# Altium schematic sheet USB.SchDoc
size 420 x 297 mm; Scale: 1:1; DocumentType: Схема электрическая принципиальная; FirstReferrence: АБВГ.123456.001
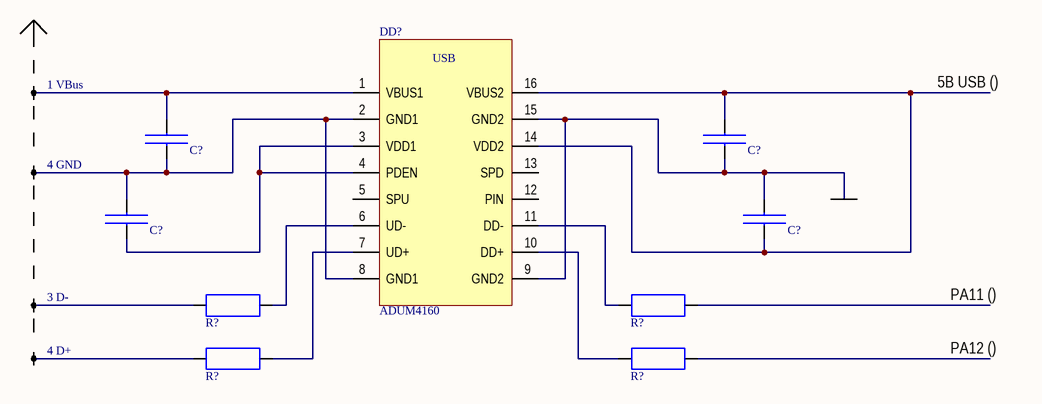
[diagram p0: USB.SchDoc]

## Parts
(Parts that share a designator on the sheet are numbered #1, #2 ... from top to bottom, then left to right.)
C?#1  C_2  (value not drawn)
C?#2  C_2  (value not drawn)
C?#3  C_2  (value not drawn)
C?#4  C_2  (value not drawn)
DD?  ADUM4160  [SOIC127P1030X265-16N]
R?#1  R_1  (value not drawn)
R?#2  R_1  (value not drawn)
R?#3  R_1  (value not drawn)
R?#4  R_1  (value not drawn)
X?#1  1 VBus  [usbB]  (part A of 4)
X?#2  4 GND  [usbB]  (part D of 4)
X?#3  3 D-  [usbB]  (part C of 4)
X?#4  4 D+  [usbB]  (part B of 4)

## Nets
NetC?#1_1: C?#1.1 C?#3.2 DD?.2(GND1) DD?.8(GND1) X?#2.4
NetC?#1_2: C?#1.2 DD?.1(VBUS1) X?#1.1
NetC?#2_1: C?#2.1 C?#4.2 DD?.9(GND2) DD?.15(GND2)
NetC?#2_2: C?#2.2 C?#4.1 DD?.14(VDD2) DD?.16(VBUS2)
NetC?#3_1: C?#3.1 DD?.3(VDD1) DD?.4(PDEN)
NetDD?_6: DD?.6(UD-) R?#1.2
NetDD?_7: DD?.7(UD+) R?#3.2
NetDD?_10: DD?.10(DD+) R?#4.2
NetDD?_11: DD?.11(DD-) R?#2.2
NetR?#1_1: R?#1.1 X?#3.3
NetR?#3_1: R?#3.1 X?#4.2

Not connected (* = marked no-connect by the designer): DD? 5(SPU) 12(PIN) 13(SPD); R?#2 1; R?#4 1

## Notes on the sheet
- 5В USB ()
- PA11 ()
- PA12 ()
- Подп. и дата
- Инв. № дубл.
- Взам. инв. №
- Инв. № подл.
- Изм.
- Лист
- № докум.
- Подп.
- Дата
- 2.106-A3
- Копировал
- Формат А3
- (in symbol ADUM4160) USB

## Library data of the parts
X?#1-X?#4 = USBB-1J